# EAGLE schematic Test3 (EAGLE 8.2.2)
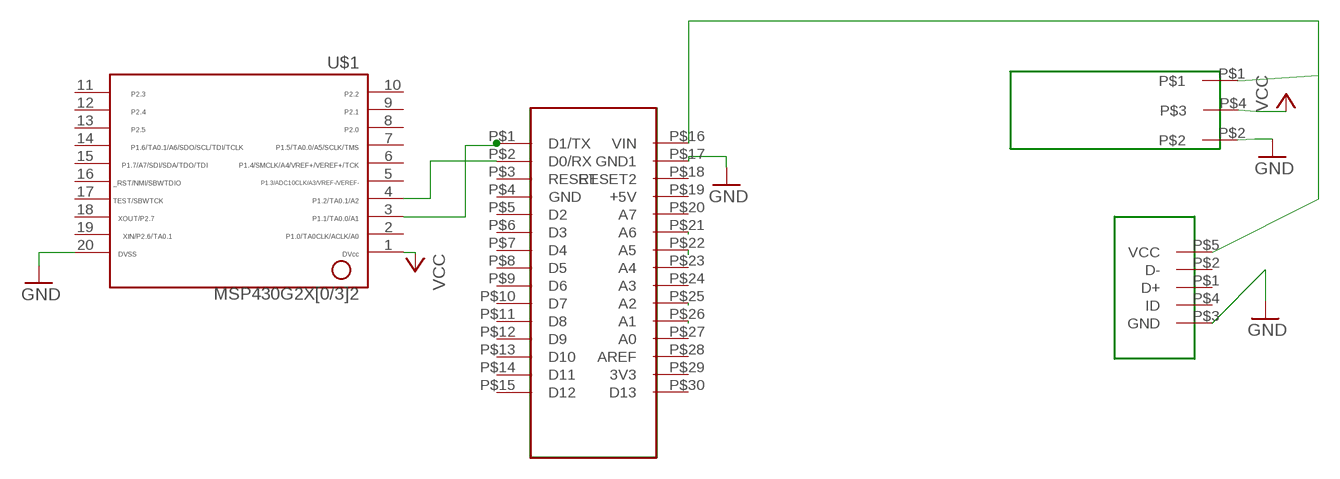
[diagram p0: schematic, sheet 1]

## Parts
U$1  MSP430G553MSP430G2553  [MSP430G553]
U$2  ARDUINONANOARDUINONAONO  [ARDUINONANO]
U$5  LMC3V3LMC3V3  [LMC3V3]
U$7  USBUSB  [USB]

## Nets
GND: U$1.20 U$2.P$17(GND1) U$5.P$2 U$7.P$3(GND)
N$2: U$1.3 U$2.P$1(D1/TX)
N$3: U$2.P$22(A5)
N$4: U$1.4 U$2.P$2(D0/RX)
N$5: U$2.P$26(A1)
N$7: U$2.P$16(VIN) U$5.P$1 U$7.P$5(VCC)
N$11: U$2.P$21(A6)
N$12: U$2.P$25(A2)
VCC: U$1.1 U$5.P$4
Unconnected: U$1.2 U$1.5 U$1.6 U$1.7 U$1.8 U$1.9 U$1.10 U$1.11 U$1.12 U$1.13 U$1.14 U$1.15 U$1.16 U$1.17 U$1.18 U$1.19 U$2.P$3(RESET) U$2.P$4(GND) U$2.P$5(D2) U$2.P$6(D3) U$2.P$7(D4) U$2.P$8(D5) U$2.P$9(D6) U$2.P$10(D7) U$2.P$11(D8) U$2.P$12(D9) U$2.P$13(D10) U$2.P$14(D11) U$2.P$15(D12) U$2.P$18(RESET2) U$2.P$19(+5V) U$2.P$20(A7) U$2.P$23(A4) U$2.P$24(A3) U$2.P$27(A0) U$2.P$28(AREF) U$2.P$29(3V3) U$2.P$30(D13) U$7.P$1(D+) U$7.P$2(D-) U$7.P$4(ID)

## Library data of the parts
U$1 = clouddemo:MSP430G553; CNT: 0; HEIGHT: 20
U$2 = clouddemo:ARDUINONANO; CNT: 0; HEIGHT: 10
U$5 = clouddemo:LMC3V3; CNT: 0; HEIGHT: 25
U$7 = clouddemo:USB; CNT: 1; HEIGHT: 15.00